# EAGLE design USB_Sound_Card_with_PCM2902 (EAGLE 9.6.2)
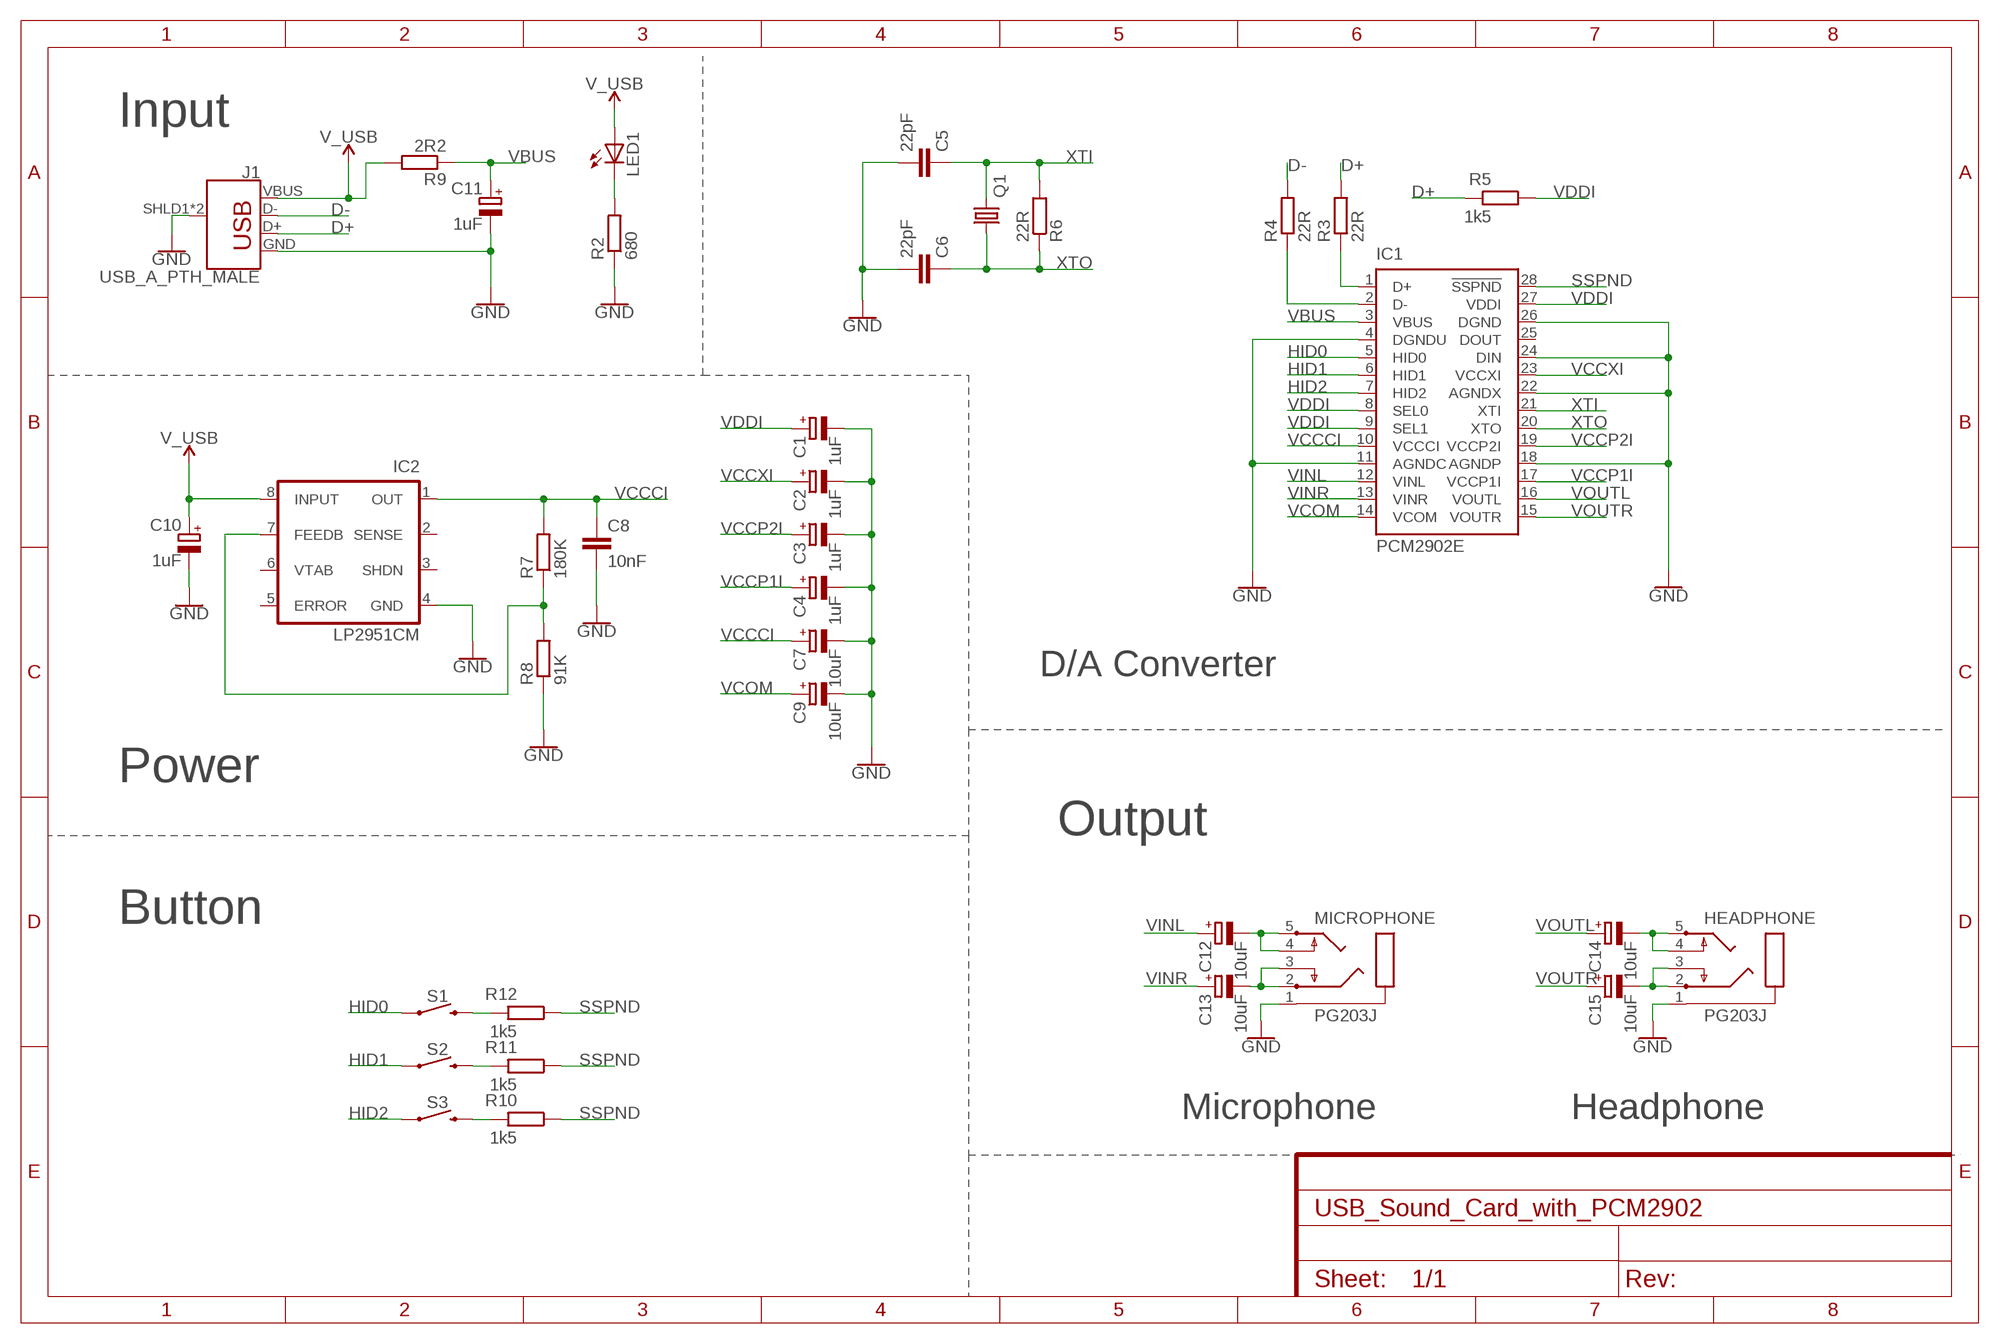
[diagram p0: schematic, sheet 1]

## Parts
C1  1uF  CPOL-EUCT3528  [CT3528]
C2  1uF  CPOL-EUCT3528  [CT3528]
C3  1uF  CPOL-EUCT3528  [CT3528]
C4  1uF  CPOL-EUCT3528  [CT3528]
C5  22pF  C-EUC0805  [C0805]
C6  22pF  C-EUC0805  [C0805]
C7  10uF  CPOL-EUCT3528  [CT3528]
C8  10nF  C-EUC0805  [C0805]
C9  10uF  CPOL-EUCT3528  [CT3528]
C10  1uF  CPOL-EUCT3528  [CT3528]
C11  1uF  CPOL-EUCT3528  [CT3528]
C12  10uF  CPOL-EUCT3528  [CT3528]
C13  10uF  CPOL-EUCT3528  [CT3528]
C14  10uF  CPOL-EUCT3528  [CT3528]
C15  10uF  CPOL-EUCT3528  [CT3528]
HEADPHONE  PG203J  [PG203J]
IC1  PCM2902E  [SSOP28DB]
IC2  LP2951CM  [SO-08]
J1  USB_A_PTH_MALE  [USB-A-H]
LED1  LEDCHIP-LED0805  [CHIP-LED0805]
MICROPHONE  PG203J  [PG203J]
Q1  CRYSTALHC49UP  [HC49UP]
R2  680  R-EU_M0805  [M0805]
R3  22R  R-EU_M0805  [M0805]
R4  22R  R-EU_M0805  [M0805]
R5  1k5  R-EU_M0805  [M0805]
R6  22R  R-EU_M0805  [M0805]
R7  180K  R-EU_M0805  [M0805]
R8  91K  R-EU_M0805  [M0805]
R9  2R2  R-EU_M0805  [M0805]
R10  1k5  R-EU_M0805  [M0805]
R11  1k5  R-EU_M0805  [M0805]
R12  1k5  R-EU_M0805  [M0805]
S1  MOMENTARY-SWITCH-SPST-PTH-6.0MM  [TACTILE_SWITCH_PTH_6.0MM]
S2  MOMENTARY-SWITCH-SPST-PTH-6.0MM  [TACTILE_SWITCH_PTH_6.0MM]
S3  MOMENTARY-SWITCH-SPST-PTH-6.0MM  [TACTILE_SWITCH_PTH_6.0MM]

## Nets
D+: J1.D+ R3.2 R5.2
D-: J1.D- R4.2
GND: C1.- C2.- C3.- C4.- C5.2 C6.2 C7.- C8.2 C9.- C10.- C11.- HEADPHONE.1 IC1.4(DGNDU) IC1.11(AGNDC) IC1.18(AGNDP) IC1.22(AGNDX) IC1.24(DIN) IC1.26(DGND) IC2.4(GND) J1.GND J1.SHLD1(SHIELD) J1.SHLD2(SHIELD) MICROPHONE.1 R2.1 R8.1
HID0: IC1.5(HID0) S1.1
HID1: IC1.6(HID1) S2.1
HID2: IC1.7(HID2) S3.1
N$1: R10.2 S3.3
N$2: IC2.7(FEEDB) R7.1 R8.2
N$3: R11.2 S2.3
N$4: R12.2 S1.3
N$5: LED1.C R2.2
N$6: IC1.1(D+) R3.1
N$7: IC1.2(D-) R4.1
N$8: C13.- MICROPHONE.2 MICROPHONE.3
N$9: C12.- MICROPHONE.4 MICROPHONE.5
N$10: C14.- HEADPHONE.4 HEADPHONE.5
N$12: C15.- HEADPHONE.2 HEADPHONE.3
SSPND: IC1.28(!SSPND) R10.1 R11.1 R12.1
V_USB: C10.+ IC2.8(INPUT) J1.VBUS LED1.A R9.2
VBUS: C11.+ IC1.3(VBUS) R9.1
VCCCI: C7.+ C8.1 IC1.10(VCCCI) IC2.1(OUT) R7.2
VCCP1I: C4.+ IC1.17(VCCP1I)
VCCP2I: C3.+ IC1.19(VCCP2I)
VCCXI: C2.+ IC1.23(VCCXI)
VCOM: C9.+ IC1.14(VCOM)
VDDI: C1.+ IC1.8(SEL0) IC1.9(SEL1) IC1.27(VDDI) R5.1
VINL: C12.+ IC1.12(VINL)
VINR: C13.+ IC1.13(VINR)
VOUTL: C14.+ IC1.16(VOUTL)
VOUTR: C15.+ IC1.15(VOUTR)
XTI: C5.1 IC1.21(XTI) Q1.2 R6.2
XTO: C6.1 IC1.20(XTO) Q1.1 R6.1
Unconnected: IC1.25(DOUT) IC2.2(SENSE) IC2.3(SHDN) IC2.5(ERROR) IC2.6(VTAB)

## Notes on the sheet
- Input
- D/A Converter
- Power
- Output
- Button
- Microphone | Headphone

## Library data of the parts
C1-C4 C7 C9-C15 = rcl:CPOL-EU: POLARIZED CAPACITOR, European symbol
C5 C6 C8 = rcl:C-EU: CAPACITOR, European symbol
HEADPHONE MICROPHONE = con-hirschmann:PG203J: MIC/HEADPHONE JACK KS-S stereo microphone/headphone jack PG203JN (Schukat); OC_FARNELL: unknown; OC_NEWARK: unknown
IC1 = texas:PCM290*: STEREO AUDIO CODEC WITH USB INTERFACE SINGLE-ENDED ANALOG INPUT/OUTPUT AND S/PDIF
IC2 = v-reg:LP2951?*: Series of Adjustable Micropower Voltage Regulators Source: http://cache.national.com/ds/LP/LP2950.pdf
J1 = SparkFun-Connectors:USB_A: USB-A Connector Male and female variants, as well as PTH and SMT variants SparkFun Products: SparkFun XBee Explorer Dongle <https://www.sparkfun.com/products/11697> PTH Male SparkFun MicroView-USB Programmer <https://www.sparkfun.com/products/12924> SMT Male SparkFun USB Type A Female Breakout <https://www.sparkfun.com/products/12700> SMT Female; PROD_ID: CONN-08367; SF_ID: PRT-00437
LED1 = led:LED: LED OSRAM: - CHIPLED LG R971, LG N971, LY N971, LG Q971, LY Q971, LO R971, LY R971 LH N974, LH R974 LS Q976, LO Q976, LY Q976 LO Q996 - Hyper CHIPLED LW Q18S LB Q993, LB Q99A, LB R99A - SideLED LS A670, LO A670, LY A670, LG A670, LP A670 LB A673, LV A673, LT A673, LW A673 LH A674 LY A675 LS A676, LA A676, LO A676, LY A676, LW A676 LS A679, LY A679, LG A679 - Hyper Micro SIDELED® LS Y876, LA Y876, LO Y876, LY Y876 LT Y87S - SmartLED LW L88C, LW L88S LB L89C, LB L89S, LG L890 LS L89K, LO L89K, LY L89K LS L896, LA L896, LO L896, LY L896 - TOPLED LS T670, LO T670, LY T670, LG T670, LP T670 LSG T670, LSP T670, LSY T670, LOP T670, LYG T670 LG T671, LOG T671, LSG T671 LB T673, LV T673, LT T673, LW T673 LH T674 LS T676, LA T676, LO T676, LY T676, LB T676, LH T676, LSB T676, LW T676 LB T67C, LV T67C, LT T67C, LS T67K, LO T67K, LY T67K, LW E67C LS E67B, LA E67B, LO E67B, LY E67B, LB E67C, LV E67C, LT E67C LW T67C LS T679, LY T679, LG T679 LS T770, LO T770, LY T770, LG T770, LP T770 LB T773, LV T773, LT T773, LW T773 LH T774 LS E675, LA E675, LY E675, LS T675 LS T776, LA T776, LO T776, LY T776, LB T776 LHGB T686 LT T68C, LB T68C - Hyper Mini TOPLED® LB M676 - Mini TOPLED Santana® LG M470 LS M47K, LO M47K, LY M47K Source: http://www.osram.convergy.de - LUMILED® LXK2-PW12-R00, LXK2-PW12-S00, LXK2-PW14-U00, LXK2-PW14-V00 LXK2-PM12-R00, LXK2-PM12-S00, LXK2-PM14-U00 LXK2-PE12-Q00, LXK2-PE12-R00, LXK2-PE12-S00, LXK2-PE14-T00, LXK2-PE14-U00 LXK2-PB12-K00, LXK2-PB12-L00, LXK2-PB12-M00, LXK2-PB14-N00, LXK2-PB14-P00, LXK2-PB14-Q00 LXK2-PR12-L00, LXK2-PR12-M00, LXK2-PR14-Q00, LXK2-PR14-R00 LXK2-PD12-Q00, LXK2-PD12-R00, LXK2-PD12-S00 LXK2-PH12-R00, LXK2-PH12-S00 LXK2-PL12-P00, LXK2-PL12-Q00, LXK2-PL12-R00 Source: www.luxeon.com
Q1 = crystal:CRYSTAL: CRYSTAL; OC_FARNELL: unknown; OC_NEWARK: unknown
R2-R12 = rcl:R-EU_: RESISTOR, European symbol
S1-S3 = SparkFun-Switches:MOMENTARY-SWITCH-SPST: Momentary Switch (Pushbutton) - SPST Normally-open (NO) SPST momentary switches (buttons, pushbuttons). Variants PTH-12MM - 12mm square, through-hole Momentary Pushbutton Switch - 12mm Square <https://www.sparkfun.com/products/9190> (COM-09190) PTH-6.0MM, PTH-6.0MM-KIT - 6.0mm square, through-hole Mini Pushbutton Switch <https://www.sparkfun.com/products/97> (COM-00097) KIT package intended for soldering kit's - only one side of pads' copper is exposed. PTH-RIGHT-ANGLE-KIT - Right-angle, through-hole Right Angle Tactile Button <https://www.sparkfun.com/products/10791> - Used on SparkFun BigTime Watch Kit <https://www.sparkfun.com/products/11734> SMD-12MM - 12mm square, surface-mount Tactile Button - SMD (12mm) <https://www.sparkfun.com/products/12993> (COM-12993) Used on SparkFun PicoBoard <https://www.sparkfun.com/products/11888> SMD-4.5MM - 4.5mm Square Trackball Switch Used on SparkFun Blackberry Trackballer Breakout <https://www.sparkfun.com/products/13169> SMD-4.6MMX2.8MM - 4.60mm x 2.80mm, surface mount Used on SparkFun SAMD21 Mini Breakout <https://www.sparkfun.com/products/13664> SMD-5.2MM, SMD-5.2-REDUNDANT - 5.2mm square, surface-mount Mini Pushbutton Switch - SMD <https://www.sparkfun.com/products/8720> (COM-08720) Used on Arduino Pro Mini <https://www.sparkfun.com/products/11114> REDUNDANT package connects both switch circuits together SMD-6.0X3.5MM - 6.0 x 3.5mm, surface mount Momentary Reset Switch SMD <https://www.sparkfun.com/products/8229> (COM-08229) SMD-6.2MM-TALL - 6.2mm square, surface mount Tactile Button - SMD (6mm) <https://www.sparkfun.com/products/12992> Used on SparkFun Digital Sandbox <https://www.sparkfun.com/products/12651> SMD-RIGHT-ANGLE - Right-angle, surface mount Used on SparkFun Block for Intel® Edison - Arduino <https://www.sparkfun.com/products/13036>; PROD_ID: SWCH-08441; SF_SKU: COM-00097

## Board
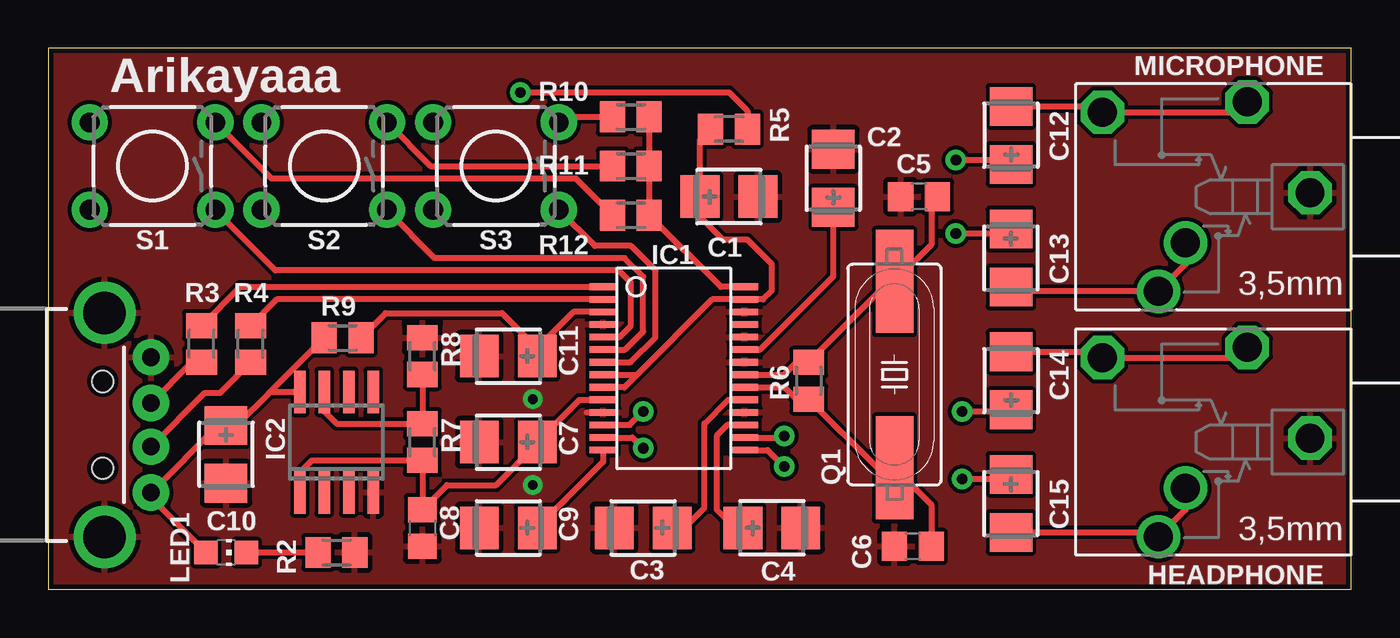
[diagram p1: board, top side]
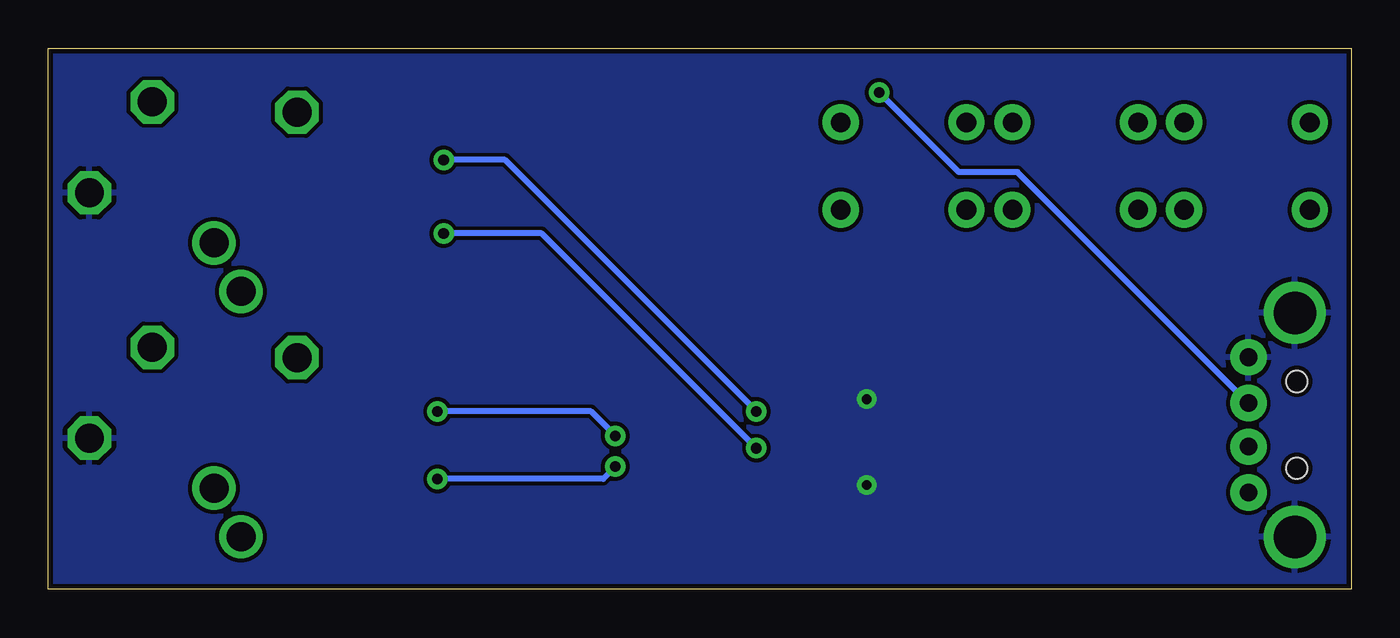
[diagram p2: board, bottom side, seen from below]

Size 67.46 x 28 mm. Coordinates in mm from the lower left corner, seen from the top.
Outline: 0,0 67.46,0 67.46,28 0,28 0,0
Copper layers (1*16): Top 0.035mm / dielectric 1.5mm / Bottom 0.035mm
Design rules "SparkFun": minimum track width 8mil, minimum drill 20mil, track to track 8mil, track to pad 8mil, pad to pad 8mil, via to via 8mil, smd to smd 8mil, copper to edge 10mil, drill to drill 8mil, minimum pad ring 12mil, minimum via ring 10mil, stop-mask expansion 4mil, vias tented up to drill 25mil, thermal gap 10mil

### Footprints (pad centres in the part's own frame; a part is rotated, then mirrored left to right if it is on the bottom)
CT3528 = smd 2 x 2.2: + 1.5,0; - -1.5,0
C0805 = smd 1.3 x 1.5: 1 -0.95,0; 2 0.95,0
PG203J = drill 1.499 octagon: 1 -5.004,-0.203; 4 5.74,-4.369; 5 -1.753,-4.902 | drill 1.499: 2 2.845,4.902; 3 1.448,2.388
SSOP28DB = smd 0.348 x 1.397: 1 -4.225,-3.656; 2 -3.575,-3.656; 3 -2.925,-3.656; 4 -2.275,-3.656; 5 -1.625,-3.656; 6 -0.975,-3.656; 7 -0.325,-3.656; 8 0.325,-3.656; 9 0.975,-3.656; 10 1.625,-3.656; 11 2.275,-3.656; 12 2.925,-3.656; 13 3.575,-3.656; 14 4.225,-3.656; 15 4.225,3.656; 16 3.575,3.656; 17 2.925,3.656; 18 2.275,3.656; 19 1.625,3.656; 20 0.975,3.656; 21 0.325,3.656; 22 -0.325,3.656; 23 -0.975,3.656; 24 -1.625,3.656; 25 -2.275,3.656; 26 -2.925,3.656; 27 -3.575,3.656; 28 -4.225,3.656
SO-08 = smd 0.6 x 2.2: 1 -1.905,-2.6; 2 -0.635,-2.6; 3 0.635,-2.6; 4 1.905,-2.6; 5 1.905,2.6; 6 0.635,2.6; 7 -0.635,2.6; 8 -1.905,2.6
USB-A-H = drill 0.914 pad 1.88: D+ 2.4,1.127; D- 2.4,-1.127; GND 2.4,3.5; VBUS 2.4,-3.5 | drill 2.2: SHLD1 0,-5.8; SHLD2 0,5.8 | hole 1.1: -0.1,2.25; -0.1,-2.25
CHIP-LED0805 = smd 1.2 x 1.2: A 0,-1.05; C 0,1.05
HC49UP = smd 5.334 x 1.93: 1 -4.826,0; 2 4.826,0
M0805 = smd 1.3 x 1.6: 1 -0.95,0; 2 0.95,0
TACTILE_SWITCH_PTH_6.0MM = drill 1.016 pad 1.88: 1 -3.251,2.261; 2 3.251,2.261; 3 -3.251,-2.261; 4 3.251,-2.261

### Placement (x,y rotation side)
C1  35.24,20.32 180 top
C2  40.64,21.27 270 top
C3  30.8,3.17 0 top
C4  37.47,3.17 180 top
C5  45.09,20.32 180 top
C6  44.77,2.22 180 top
C7  23.81,7.62 0 top
C8  19.37,3.17 270 top
C9  23.81,3.17 0 top
C10  9.21,6.99 90 top
C11  23.81,12.06 0 top
C12  49.85,23.5 270 top
C13  49.85,17.14 90 top
C14  49.85,10.79 270 top
C15  49.85,4.45 90 top
HEADPHONE  60.33,7.62 180 top
IC1  32.38,11.43 270 top
IC2  14.92,7.62 0 top
J1  2.92,8.51 0 top
LED1  9.21,1.91 270 top
MICROPHONE  60.33,20.32 180 top
Q1  43.81,11.11 90 top
R2  14.92,1.91 180 top
R3  7.94,12.7 270 top
R4  10.48,12.7 270 top
R5  35.24,23.81 0 top
R6  39.37,10.79 90 top
R7  19.37,7.62 270 top
R8  19.37,12.06 270 top
R9  15.24,13.02 180 top
R10  30.16,24.45 180 top
R11  30.16,21.91 180 top
R12  30.16,19.37 180 top
S1  5.4,21.91 180 top
S2  14.29,21.91 180 top
S3  23.18,21.91 180 top

### Tracks (layer width: path | path; a pad name or v marks a point on that pad's centre or on a via)
D+  (via drill 0.55 pad 0.55)
  Top 0.305: J1.D+ 7.43,11.75 R3.2 | v24.45,25.72 35.24,25.72 36.2,24.77 R5.2
  Bottom 0.305: J1.D+ 17.27,21.59 20.32,21.59 v24.45,25.72
D-
  Top 0.305: J1.D- 8.1,10.16 8.89,10.16 R4.2
GND  (via drill 0.51)
  Top 0.305: 27.89,9.15 IC1.11
  other vias: 25.08,9.84 25.08,5.4
  pour Top: -2.54,30.48 -2.54,-2.54 69.85,-2.54 69.85,30.48
  pour Bottom: -5.08,33.02 -5.08,-5.08 72.39,-5.08 72.39,33.02
HID0
  Top 0.305: IC1.5 29.57,13.05 30.16,13.65 30.16,15.88 29.53,16.51 11.75,16.51 8.65,19.61 S1.1
HID1
  Top 0.305: IC1.6 29.87,12.4 30.8,13.34 30.8,16.19 29.84,17.14 20,17.14 17.54,19.61 S2.1
HID2
  Top 0.305: IC1.7 30.16,11.76 31.43,13.03 31.43,16.51 30.16,17.78 28.3,17.78 S3.1
N$1
  Top 0.305: S3.3 26.71,24.45 R10.2
N$2
  Top 0.305: R8.2 R7.1 14.93,8.57 14.29,9.21 IC2.7
N$3
  Top 0.305: S2.3 19.8,21.91 R11.2
N$4
  Top 0.305: S1.3 11.54,21.27 27.31,21.27 R12.2
N$5
  Top 0.305: LED1.C R2.2
N$6
  Top 0.305: R3.1 9.94,15.65 IC1.1
N$7
  Top 0.305: IC1.2 11.83,15.01 R4.1
N$8
  Top 0.305: MICROPHONE.3 58.88,16.82 MICROPHONE.2 50.08,15.42 C13.-
N$9
  Top 0.305: C12.- 54.28,25 MICROPHONE.4 61.54,24.69 MICROPHONE.5
N$10
  Top 0.305: C14.- 54.28,12.29 HEADPHONE.4 61.54,11.99 HEADPHONE.5
N$12
  Top 0.305: C15.- 57.25,2.94 HEADPHONE.2 58.88,4.12 HEADPHONE.3
SSPND
  Top 0.305: R10.1 R11.1 R12.1 34.83,15.65 IC1.28
V_USB
  Top 0.305: LED1.A 5.32,4.74 J1.VBUS 8.8,8.48 C10.+ 9.76,8.48 11.43,10.16 11.49,10.22 | 11.49,10.22 R9.2 | 11.49,10.22 IC2.8
VBUS
  Top 0.305: R9.1 17.46,14.29 23.5,14.29 25.31,12.47 | 25.31,12.47 C11.+ | IC1.3 27.2,14.36 25.31,12.47
VCCCI
  Top 0.305: IC1.10 27.5,9.8 C7.+ 25.31,7.53 23.18,5.4 20.64,5.4 C8.1 R7.2 13.65,6.67 13.02,6.03 IC2.1
VCCP1I
  Top 0.305: IC1.17 35.17,8.51 34.61,7.94 34.61,4.13 35.56,3.17 C4.+
VCCP2I
  Top 0.305: C3.+ 32.93,3.17 33.97,4.21 33.97,8.57 35.2,9.8 IC1.19
VCCXI
  Top 0.305: IC1.23 36.85,12.4 40.64,16.19 C2.+
VCOM
  Top 0.305: IC1.14 28.73,6.59 C9.+
VDDI
  Top 0.305: IC1.8 30.47,11.11 | 30.47,11.11 34.37,15.01 IC1.27 37.01,15.01 37.47,15.46 37.47,16.83 36.2,18.1 34.92,18.1 33.74,19.28 C1.+ 33.74,23.26 R5.1 | 30.47,11.11 29.82,10.46 IC1.9
VINL  (via drill 0.55)
  Top 0.305: IC1.12 30.09,8.51 v30.8,9.21 | v46.99,22.23 49.62,22.23 C12.+
  Bottom 0.305: v30.8,9.21 43.81,22.23 v46.99,22.23
VINR  (via drill 0.55)
  Top 0.305: IC1.13 30.25,7.86 v30.8,7.3 | v46.99,18.41 49.62,18.41 C13.+
  Bottom 0.305: v30.8,7.3 41.91,18.41 v46.99,18.41
VOUTL  (via drill 0.55)
  Top 0.305: IC1.16 38.02,7.86 v38.1,7.94 | v47.31,9.21 49.76,9.21 C14.+
  Bottom 0.305: v38.1,7.94 39.37,9.21 v47.31,9.21
VOUTR  (via drill 0.55)
  Top 0.305: IC1.15 37.24,7.21 v38.1,6.35 | v47.31,5.71 49.62,5.71 C15.+
  Bottom 0.305: v38.1,6.35 38.73,5.71 v47.31,5.71
XTI
  Top 0.305: IC1.21 38.09,11.11 38.73,11.74 R6.2 43.56,15.94 Q1.2 45.72,17.84 45.72,20 C5.1
XTO
  Top 0.305: IC1.20 38.12,10.46 38.73,9.85 R6.1 42.93,6.29 Q1.1 45.72,4.38 C6.1

### Text on the board
tPlace: Arikayaaa